# EAGLE design Color Sorter PROTOTYPE v3 DMJ Edit (EAGLE 6.4)
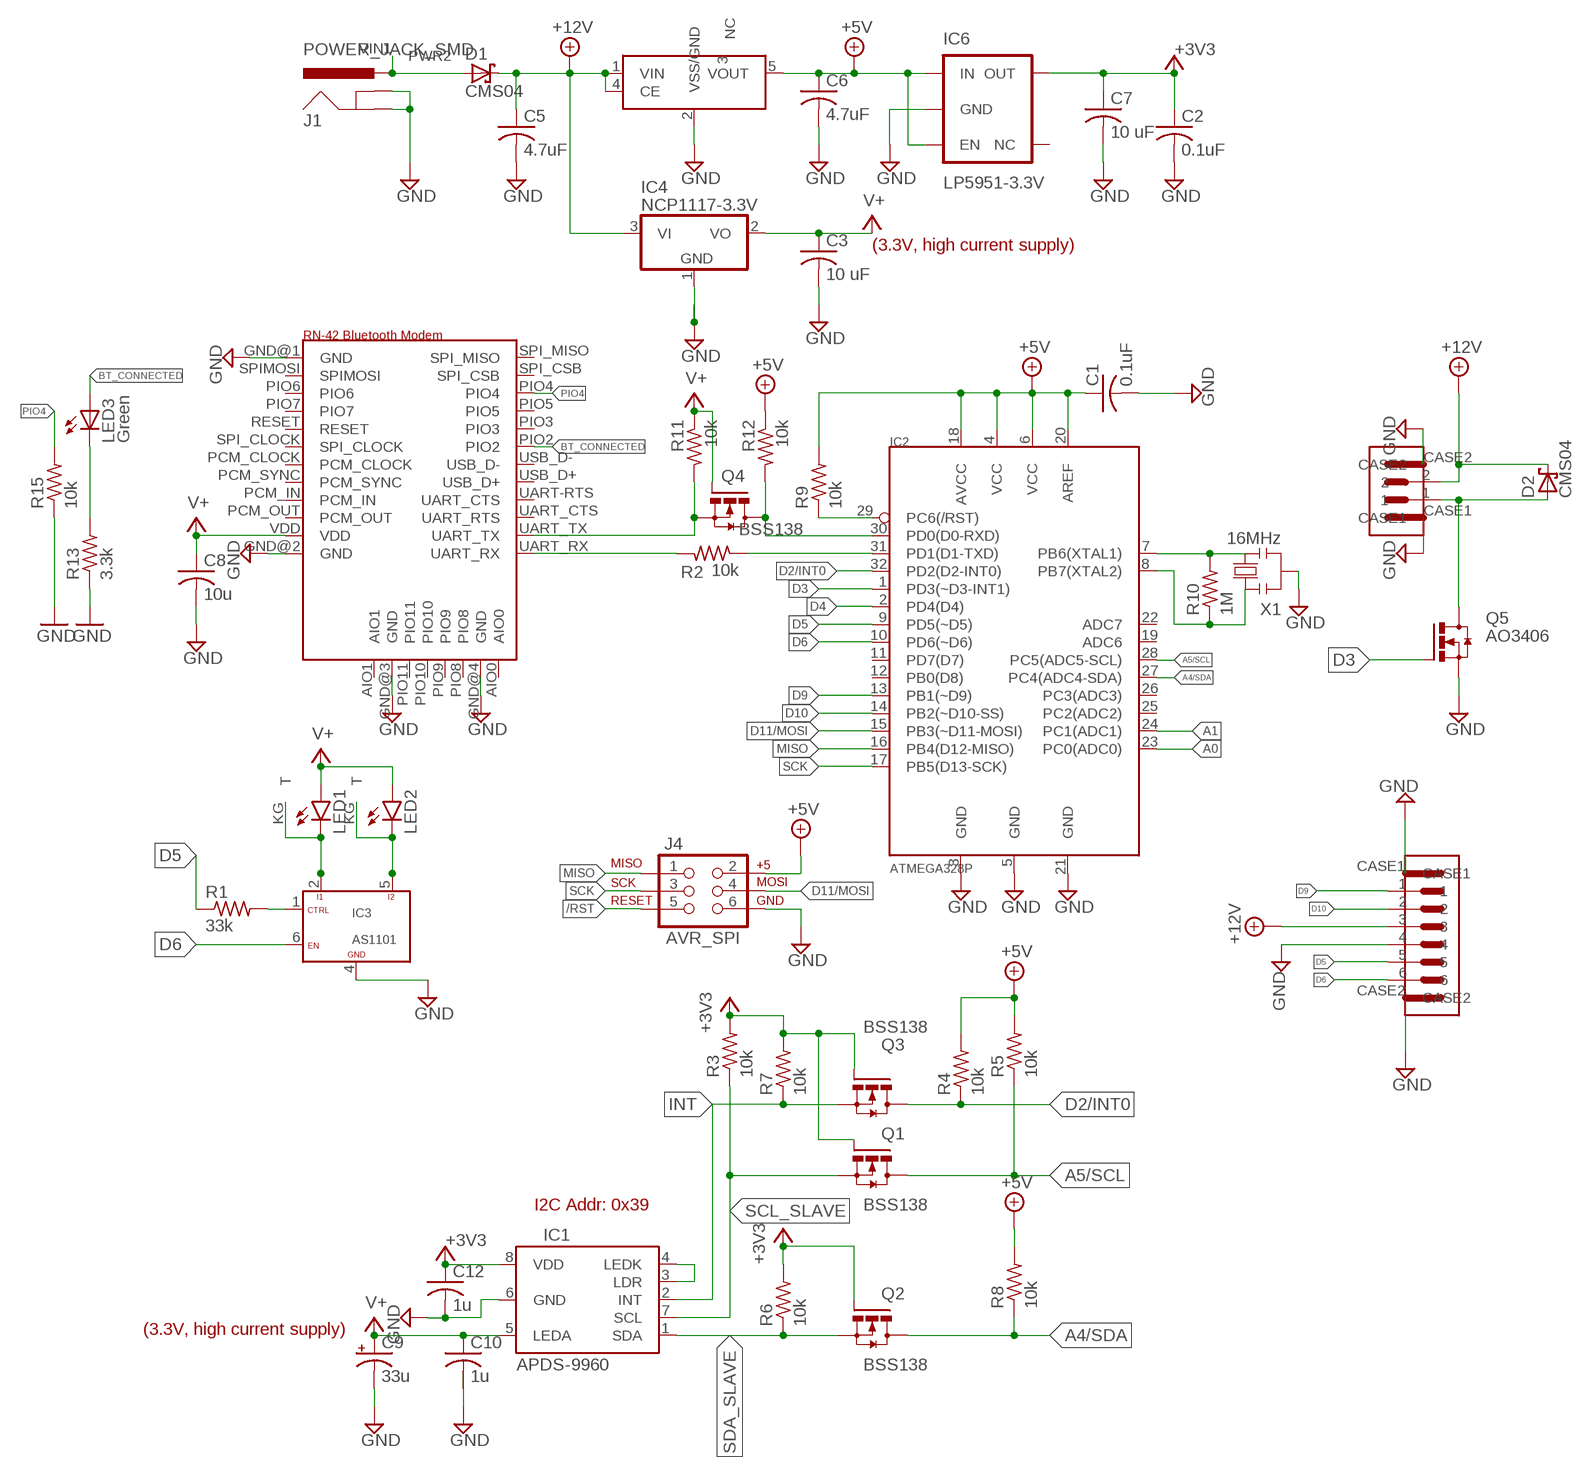
[diagram p0: schematic, sheet 1]

## Parts
A1  RN-42_BLUETOOTH  [RN-42]
C1  0.1uF  C-USC0805  [C0805]
C2  0.1uF  C-USC0805  [C0805]
C3  10 uF  C-USC0805  [C0805]
C5  4.7uF  C-USC0805  [C0805]
C6  4.7uF  C-USC0805  [C0805]
C7  10 uF  C-USC0805  [C0805]
C8  10u  C-USC0805  [C0805]
C9  33u  CPOL-USCT7343  [CT7343]
C10  1u  C-USC0805  [C0805]
C12  1u  C-USC0805  [C0805]
D1  CMS04  CMS04_SCHOTTKY  [3-4E1A]
D2  CMS04  CMS04_SCHOTTKY  [3-4E1A]
IC1  APDS-9960  SPARKFUN-SENSORS_APDS-9960  [SPARKFUN-SENSORS_APDS-9960]
IC2  ATMEGA328P  ATMEGA328P_TQFP  [TQFP-32]
IC3  AS1101  AS1101-T  [SC70-6]
IC4  NCP1117-3.3V  NCP1117_REGULATOR  [SOT-223]
IC5  XC6701-5V  DMJ_LINEAR_XC6701B502  [DMJ_LINEAR_SOT23-5]
IC6  LP5951-3.3V  [SOT23-5]
J1  POWER_JACK_SMD  [SMD_POWER_JACK]
J4  AVR_SPI  AVR_SPI_PRG_6PTH  [2X3]
LED1  LED_SAMSUNG_SPMWHT541MD7WATMS0  [LED_SAMSUNG_SPMWHT541MD7WATMS0]
LED2  LED_SAMSUNG_SPMWHT541MD7WATMS0  [LED_SAMSUNG_SPMWHT541MD7WATMS0]
LED3  Green  LED1206  [LED-1206]
Q1  BSS138  BE-420-CUSTOM-PARTS_BSS138_N_CHANNEL_MOSFET  [BE-420-CUSTOM-PARTS_SOT-23]
Q2  BSS138  BE-420-CUSTOM-PARTS_BSS138_N_CHANNEL_MOSFET  [BE-420-CUSTOM-PARTS_SOT-23]
Q3  BSS138  BE-420-CUSTOM-PARTS_BSS138_N_CHANNEL_MOSFET  [BE-420-CUSTOM-PARTS_SOT-23]
Q4  BSS138  BE-420-CUSTOM-PARTS_BSS138_N_CHANNEL_MOSFET  [BE-420-CUSTOM-PARTS_SOT-23]
Q5  AO3406  N_PWR_MOSFET_AO3406  [SOT-23-3]
R1  33k  R-US_R0805  [R0805]
R2  10k  R-US_R0805  [R0805]
R3  10k  R-US_R0805  [R0805]
R4  10k  R-US_R0805  [R0805]
R5  10k  R-US_R0805  [R0805]
R6  10k  R-US_R0805  [R0805]
R7  10k  R-US_R0805  [R0805]
R8  10k  R-US_R0805  [R0805]
R9  10k  R-US_R0805  [R0805]
R10  1M  R-US_R0805  [R0805]
R11  10k  R-US_R0805  [R0805]
R12  10k  R-US_R0805  [R0805]
R13  3.3k  R-US_R0805  [R0805]
R15  10k  R-US_R0805  [R0805]
U$4  1A-JENKINS-PHOENIX-CONTACT-CONNECTORS_1A_JENKINS_2013_6PIN_SMD_PHOENIX_CONTACT  [1A-JENKINS-PHOENIX-CONTACT-CONNECTORS_1A_JENKINS_2013_6-PIN-R/A_PHOENIX_SMD]
U$7  1A_JENKINS_2013_2PIN_SMD_PHOENIX_CONTACT  [1A_JENKINS_2013_2-PIN-R/A_PHOENIX_SMD]
X1  16MHz  1A_JENKINS_2013_CSTCE16MHZ  [1A_JENKINS_2013_RESONATOR_SMD]

## Nets
+3V3: C2.1 C7.1 C12.1 IC1.8(VDD) IC6.5(OUT) Q1.1-G(G) Q2.1-G(G) Q3.1-G(G) R3.2 R6.2 R7.2
+5V: C1.1 C6.1 IC2.4(VCC) IC2.6(VCC) IC2.18(AVCC) IC2.20(AREF) IC5.5(VOUT) IC6.1(IN) IC6.3(EN) J4.2 R4.2 R5.2 R8.2 R9.2 R12.1
+12V: C5.1 D1.C D2.C IC4.3(VI) IC5.1(VIN) IC5.4(CE) U$4.3 U$7.2
/RST: IC2.29(PC6(/RST)) J4.5 R9.1
A0: IC2.23(PC0(ADC0))
A1: IC2.24(PC1(ADC1))
A4/SDA: IC2.27(PC4(ADC4-SDA)) Q2.3-D(D) R8.1
A5/SCL: IC2.28(PC5(ADC5-SCL)) Q1.3-D(D) R5.1
BT_CONNECTED: A1.PIO2 LED3.A
D2/INT0: IC2.32(PD2(D2-INT0)) Q3.3-D(D) R4.1
D3: IC2.1(PD3(~D3-INT1)) Q5.1(G)
D4: IC2.2(PD4(D4))
D5: IC2.9(PD5(~D5)) R1.1 U$4.5
D6: IC2.10(PD6(~D6)) IC3.6(EN) U$4.6
D9: IC2.13(PB1(~D9)) U$4.1
D10: IC2.14(PB2(~D10-SS)) U$4.2
D11/MOSI: IC2.15(PB3(~D11-MOSI)) J4.4
GND: A1.GND@1(GND) A1.GND@2(GND) A1.GND@3(GND) A1.GND@4(GND) C1.2 C2.2 C3.2 C5.2 C6.2 C7.2 C8.2 C9.- C10.2 C12.2 IC1.6(GND) IC2.3(GND) IC2.5(GND) IC2.21(GND) IC3.4(GND) IC4.1(GND) IC5.2(VSS/GND) IC6.2(GND) J1.GND J1.P$4(GNDBREAK) J4.6 Q5.2(S) R13.1 R15.1 U$4.4 U$4.CASE1 U$4.CASE2 U$7.CASE1 U$7.CASE2 X1.2
INT: IC1.2(INT) Q3.2-S(S) R7.1
MISO: IC2.16(PB4(D12-MISO)) J4.1
N$1: IC2.31(PD1(D1-TXD)) R2.1
N$2: IC1.3(LDR) IC1.4(LEDK)
N$4: IC2.7(PB6(XTAL1)) R10.2 X1.3
N$5: IC3.2(I1) LED1.KA(C) LED1.KG(T)
N$6: IC3.5(I2) LED2.KA(C) LED2.KG(T)
N$8: A1.UART_RX R2.2
N$9: IC2.8(PB7(XTAL2)) R10.1 X1.1
N$10: D2.A Q5.3(D) U$7.1
N$11: A1.UART_TX Q4.2-S(S) R11.2
N$12: IC2.30(PD0(D0-RXD)) Q4.3-D(D) R12.2
N$16: LED3.C R13.2
N$22: IC3.1(CTRL) R1.2
PIO4: A1.PIO4 R15.2
SCK: IC2.17(PB5(D13-SCK)) J4.3
SCL_SLAVE: IC1.7(SCL) Q1.2-S(S) R3.1
SDA_SLAVE: IC1.1(SDA) Q2.2-S(S) R6.1
USB_VIN: D1.A J1.VIN0(PWR) J1.VIN1(PWR2)
V+: A1.VDD C3.1 C8.1 C9.+ C10.1 IC1.5(LEDA) IC4.2(VO) LED1.A LED2.A Q4.1-G(G) R11.1
Unconnected: A1.AIO0 A1.AIO1 A1.PCM_CLOCK A1.PCM_IN A1.PCM_OUT A1.PCM_SYNC A1.PIO3 A1.PIO5 A1.PIO6 A1.PIO7 A1.PIO8 A1.PIO9 A1.PIO10 A1.PIO11 A1.RESET A1.SPI_CLOCK A1.SPI_CSB A1.SPI_MISO A1.SPIMOSI A1.UART-RTS(UART_CTS) A1.UART_CTS(UART_RTS) A1.USB_D+ A1.USB_D- IC2.11(PD7(D7)) IC2.12(PB0(D8)) IC2.19(ADC6) IC2.22(ADC7) IC2.25(PC2(ADC2)) IC2.26(PC3(ADC3)) IC5.3(NC) IC6.4(NC)

## Notes on the sheet
- (3.3V, high current supply)
- I2C Addr: 0x39
- (3.3V, high current supply)

## Library data of the parts
A1 = be-420-custom-parts:RN-42_BLUETOOTH
C1-C3 C5-C8 C10 C12 = rcl:C-US: CAPACITOR, American symbol
C9 = rcl:CPOL-US: POLARIZED CAPACITOR, American symbol
D1 D2 = 1A_Jenkins_2013:CMS04_SCHOTTKY
IC1 = SparkFun_APDS-9960:SPARKFUN-SENSORS_APDS-9960: Avago APDS-9960 digital proximity, ambient light, RGB, and gesture sensor.; PROD_ID: SEN-12005
IC2 = 1A_Jenkins_2013:ATMEGA328P_TQFP
IC3 = 1A_Jenkins_2013:AS1101-T: AS1101 low dropout LED driver, 2 channel < 80 mA each
IC4 = 1A_Jenkins_2013:NCP1117_REGULATOR
IC5 = BE 420 Parts volume 2:DMJ_LINEAR_XC6701B502
IC6 = BE482:LP5951-3.3V
J1 = 1A_Jenkins_2013:POWER_JACK_SMD
J4 = SparkFun:AVR_SPI_PRG_6: AVR ISP 6 Pin This is the reduced ISP connector for AVR programming. Common on Arduino. This footprint will take up less PCB space and can be used with a 10-pin to 6-pin adapter such as SKU: BOB-08508
LED1 LED2 = 1A_Jenkins_2013:LED_SAMSUNG_SPMWHT541MD7WATMS0
LED3 = SparkFun:LED: LEDs Standard schematic elements and footprints for 5mm, 3mm, 1206, and 0603 sized LEDs. 5mm - Spark Fun Electronics SKU : COM-00529 (and others)
Q1-Q4 = BE 420 Parts volume 2:BE-420-CUSTOM-PARTS_BSS138_N_CHANNEL_MOSFET
Q5 = 1A_Jenkins_2013:N_PWR_MOSFET_AO3406
R1-R13 R15 = rcl:R-US_: RESISTOR, American symbol
U$4 = BE+420+Fall+2015:1A-JENKINS-PHOENIX-CONTACT-CONNECTORS_1A_JENKINS_2013_6PIN_SMD_PHOENIX_CONTACT
U$7 = 1A-Jenkins Phoenix Contact Connectors:1A_JENKINS_2013_2PIN_SMD_PHOENIX_CONTACT
X1 = BE 420 Parts volume 2:1A_JENKINS_2013_CSTCE16MHZ

## Net classes
1 VCC: width 0.381 mm
2 LEDPower: width 0.203 mm
3 ButtonSignal: width 0.203 mm

## Board
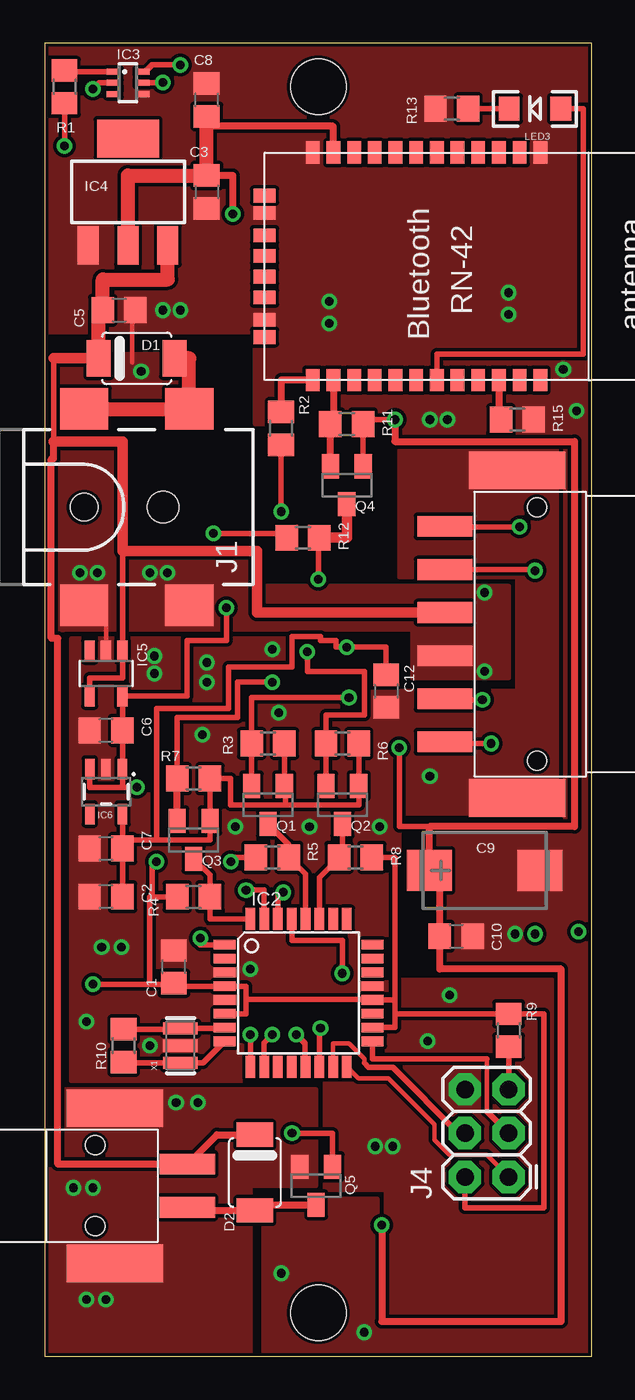
[diagram p1: board, top side]
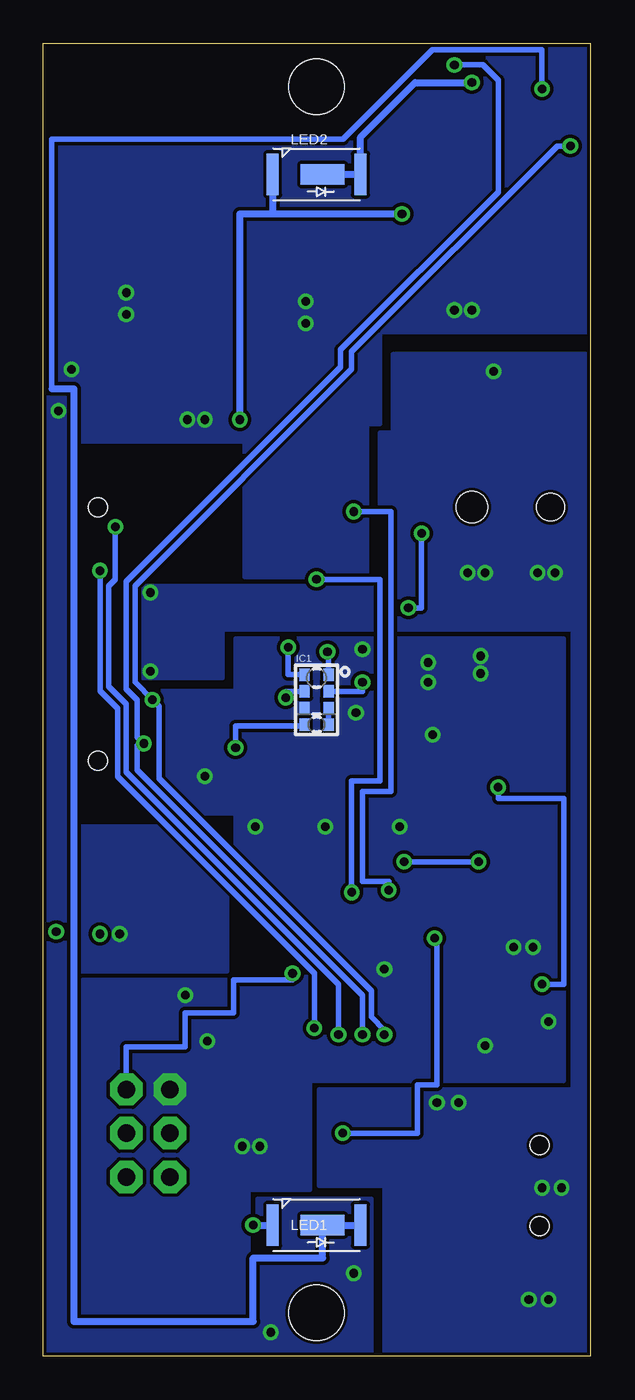
[diagram p2: board, bottom side, seen from below]

Size 31.75 x 76.2 mm. Coordinates in mm from the lower left corner, seen from the top.
Outline: 0,0 31.75,0 31.75,76.2 0,76.2 0,0
Copper layers (1*16): Top 0.035mm / dielectric 1.5mm / Bottom 0.035mm
Design rules "default *": minimum track width 10mil, minimum drill 18mil, track to track 8mil, track to pad 8mil, pad to pad 8mil, via to via 8mil, smd to smd 8mil, copper to edge 8mil, drill to drill 8mil, minimum pad ring 10mil, minimum via ring 8mil, stop-mask expansion 4mil, vias tented up to drill 0mil, thermal gap 10mil
Holes 3.2 mm at 15.88,2.54 15.88,73.66

### Footprints (pad centres in the part's own frame; a part is rotated, then mirrored left to right if it is on the bottom)
RN-42 = smd 0.8 x 1.3: AIO0 4.1,-12.9; AIO1 -4.1,-12.9; GND@3 -3.1,-12.9; GND@4 3.1,-12.9; PIO8 1.8,-12.9; PIO9 0.6,-12.9; PIO10 -0.6,-12.9; PIO11 -1.8,-12.9 | smd 1.3 x 0.8: GND@1 -6.6,3.1; GND@2 -6.6,-10.1; PCM_CLOCK -6.6,-4.1; PCM_IN -6.6,-6.5; PCM_OUT -6.6,-7.7; PCM_SYNC -6.6,-5.3; PIO2 6.6,-2.9; PIO3 6.6,-1.7; PIO4 6.6,0.7; PIO5 6.6,-0.5; PIO6 -6.6,0.7; PIO7 -6.6,-0.5; RESET -6.6,-1.7; SPI_CLOCK -6.6,-2.9; SPI_CSB 6.6,1.9; SPI_MISO 6.6,3.1; SPIMOSI -6.6,1.9; UART-RTS 6.6,-7.7; UART_CTS 6.6,-6.5; UART_RX 6.6,-10.1; UART_TX 6.6,-8.9; USB_D+ 6.6,-5.3; USB_D- 6.6,-4.1; VDD -6.6,-8.9
C0805 = smd 1.3 x 1.5: 1 -0.95,0; 2 0.95,0
CT7343 = smd 2.6 x 2.4: + -3.2,0; - 3.2,0
3-4E1A = smd 1.4 x 2.1: A 2.2,0; C -2.2,0
SPARKFUN-SENSORS_APDS-9960 = smd 0.6 x 0.72: 1 0.7,1.455; 2 0.7,0.485; 3 0.7,-0.485; 4 0.7,-1.455; 5 -0.7,-1.455; 6 -0.7,-0.485; 7 -0.7,0.485; 8 -0.7,1.455
TQFP-32 = smd 1.27 x 0.559: 1 -4.293,2.8; 2 -4.293,2; 3 -4.293,1.2; 4 -4.293,0.4; 5 -4.293,-0.4; 6 -4.293,-1.2; 7 -4.293,-2; 8 -4.293,-2.8; 17 4.293,-2.8; 18 4.293,-2; 19 4.293,-1.2; 20 4.293,-0.4; 21 4.293,0.4; 22 4.293,1.2; 23 4.293,2; 24 4.293,2.8 | smd 0.559 x 1.27: 9 -2.8,-4.293; 10 -2,-4.293; 11 -1.2,-4.293; 12 -0.4,-4.293; 13 0.4,-4.293; 14 1.2,-4.293; 15 2,-4.293; 16 2.8,-4.293; 25 2.8,4.293; 26 2,4.293; 27 1.2,4.293; 28 0.4,4.293; 29 -0.4,4.293; 30 -1.2,4.293; 31 -2,4.293; 32 -2.8,4.293
SC70-6 = smd 0.35 x 0.8: 1 -0.63,-0.85; 2 0.02,-0.85; 3 0.67,-0.85; 4 0.67,0.85; 5 0.02,0.85; 6 -0.63,0.85
SOT-223 = smd 1.219 x 2.235: 1 -2.311,-3.099; 2 0,-3.099; 3 2.311,-3.099 | smd 3.6 x 2.2: 4 0,3.099
DMJ_LINEAR_SOT23-5 = smd 0.6 x 1.2: 1 -0.95,-1.306; 2 0,-1.306; 3 0.95,-1.306; 4 0.95,1.306; 5 -0.95,1.306
SOT23-5 = smd 0.55 x 1.2: 1 -0.95,-1.3; 2 0,-1.3; 3 0.95,-1.3; 4 0.95,1.3; 5 -0.95,1.3
SMD_POWER_JACK = smd 2.8 x 2.4: GND -2.54,-5.7; P$4 3.56,-5.7; VIN0 -2.54,5.7; VIN1 3.56,5.7 | hole 1.6: -2.54,0 | hole 1.803: 2.032,0
2X3 = drill 1.016 pad 1.88 octagon: 1 0,0; 2 0,2.54; 3 2.54,0; 4 2.54,2.54; 5 5.08,0; 6 5.08,2.54
LED_SAMSUNG_SPMWHT541MD7WATMS0 = smd 0.7 x 2.4: A -2.55,0; KA 2.55,0 | smd 2.55 x 1.18: KG 0.35,0
LED-1206 = smd 1.2 x 1.4: A -1.5,0; C 1.5,0
BE-420-CUSTOM-PARTS_SOT-23 = smd 1 x 1.4: 1-G -0.95,-1.1; 2-S 0.95,-1.1; 3-D 0,1.1
SOT-23-3 = smd 1.4 x 1: 1 -1.1,0.95; 2 -1.1,-0.95; 3 1.1,0
R0805 = smd 1.3 x 1.5: 1 -0.95,0; 2 0.95,0
1A-JENKINS-PHOENIX-CONTACT-CONNECTORS_1A_JENKINS_2013_6-PIN-R/A_PHOENIX_SMD = smd 1.2 x 3.2: 1 6.25,3.45; 2 3.75,3.45; 3 1.25,3.45; 4 -1.25,3.45; 5 -3.75,3.45; 6 -6.25,3.45 | smd 2.2 x 5.6: CASE1 9.5,-0.75; CASE2 -9.5,-0.75 | hole 1.1: -7.35,-1.9; 7.35,-1.9
1A_JENKINS_2013_2-PIN-R/A_PHOENIX_SMD = smd 1.2 x 3.2: 1 1.25,3.45; 2 -1.25,3.45 | smd 2.2 x 5.6: CASE1 4.5,-0.75; CASE2 -4.5,-0.75 | hole 1.1: -2.35,-1.9; 2.35,-1.9
1A_JENKINS_2013_RESONATOR_SMD = smd 0.7 x 2: 1 -1,0; 2 0,0; 3 1,0

### Placement (x,y rotation side)
A1  25.65,63.25 270 top
C1  7.49,22.61 90 top
C2  3.56,26.67 180 top
C3  9.4,67.56 270 top
C5  4.32,60.71 0 top
C6  3.56,36.32 180 top
C7  3.56,29.46 180 top
C8  9.4,72.9 90 top
C9  25.53,28.19 0 top
C10  23.88,24.38 0 top
C12  19.81,38.61 270 top
D1  5.33,57.91 0 top
D2  12.19,10.67 270 top
IC1  15.88,38.1 0 bottom
IC2  14.73,21.08 0 top
IC3  4.83,73.91 270 top
IC4  4.83,67.56 0 top
IC5  3.56,39.62 180 top
IC6  3.56,32.77 180 top
J1  4.83,49.28 0 top
J4  26.92,10.41 90 top
LED1  15.88,7.62 0 bottom
LED2  15.88,68.58 0 bottom
LED3  28.45,72.39 180 top
Q1  12.95,32 180 top
Q2  17.27,32 180 top
Q3  8.64,29.97 180 top
Q4  17.53,50.55 180 top
Q5  15.75,9.91 270 top
R1  1.14,73.66 90 top
R2  13.72,53.85 90 top
R3  12.95,35.56 0 top
R4  8.64,26.67 180 top
R5  13.21,28.96 180 top
R6  17.27,35.56 0 top
R7  8.64,33.53 0 top
R8  18.03,28.96 0 top
R9  26.92,18.92 90 top
R10  4.57,18.03 90 top
R11  17.53,54.1 180 top
R12  14.99,47.5 0 top
R13  23.62,72.39 0 top
R15  27.43,54.36 180 top
U$4  26.67,41.91 90 top
U$7  4.83,9.91 270 top
X1  7.87,18.03 90 top

### Tracks (layer width: path | path; a pad name or v marks a point on that pad's centre or on a via)
+3V3  (via drill 0.5)
  Top 0.305: C12.1 19.81,41.15 v17.53,41.15 16.89,41.15 16.89,41.53 16,41.53 16,41.78 14.35,41.78 14.35,40.01 10.67,40.01 10.67,37.59 6.48,37.59 6.48,29.97 | IC6.5 4.51,29.97 | 4.51,29.97 C7.1 C2.1 | 6.48,29.97 9.59,29.97 Q3.1-G R7.2 10.79,33.53 10.79,32 13.97,32 | 6.48,29.97 4.51,29.97 | 13.97,32 18.22,32 Q2.1-G R6.2 | 13.97,32 13.97,33.1 Q1.1-G R3.2
  Bottom 0.305: IC1.8 17.53,39.55 v17.53,41.15
+5V  (via drill 0.5)
  Top 0.305: 4.51,33.02 IC6.1 C6.1 IC5.5 8.26,38.32 8.26,41.53 10.54,41.53 v10.54,43.43 | 4.51,33.02 2.61,33.02 IC6.3 | 4.51,33.02 v5.33,33.02 | 6.1,21.59 7.87,21.59 C1.1 8.05,21.48 IC2.4 11.68,21.48 11.68,20.7 | 11.68,20.7 11.68,19.88 IC2.6 | R4.2 6.22,26.67 | 6.22,26.67 6.1,26.67 6.1,21.59 | R5.2 10.79,28.96 v10.79,28.7 | v6.48,28.7 6.22,28.7 6.22,26.67 | R8.2 20.32,28.96 20.32,20.68 | 20.32,20.68 IC2.20 19.02,20.7 11.68,20.7 | IC2.18 20.32,19.08 20.32,19.87 | 20.32,19.87 20.32,20.68 | 20.32,19.87 R9.2 28.96,19.87 28.96,8.64 24.38,8.64 J4.2 | v9.78,47.75 14.04,47.75 R12.1 | 6.1,21.59 v2.79,21.59
  Bottom 0.305: v5.33,33.02 5.33,32.38 1.52,32.38 1.52,21.59 v2.79,21.59 | v10.79,28.7 v6.48,28.7 | v9.78,47.75 9.78,43.43 v10.54,43.43
+12V
  Top 0.305: 0.51,57.91 0.51,53.09 | 4.51,46.74 IC5.1 4.51,39.37 2.61,39.37 IC5.4
  Top 0.406: 0.51,53.09 0.51,52.07 0.38,52.07 0.38,41.66 0.76,41.66 0.76,11.16 U$7.2 9.99,12.87 D2.C
  Top 0.61: D1.C 0.51,57.91 | 0.51,53.09 4.51,53.09 4.51,46.74 12.32,46.74 12.32,43.16 U$4.3
  Top 0.813: D1.C 3.13,60.71 C5.1 3.37,62.48 7.14,62.48 IC4.3
/RST  (via drill 0.5)
  Top 0.305: J4.5 R9.1 | v17.27,22.23 17.27,24.13 14.35,24.13 14.35,25.38 IC2.29
  Bottom 0.305: J4.5 R9.1 23.5,17.97 23.5,19.94 20.7,19.94 20.7,21.84 17.27,21.84 v17.27,22.23
A4/SDA
  Top 0.305: IC2.27 15.93,27.8 R8.1 17.27,29.14 Q2.3-D
A5/SCL
  Top 0.305: IC2.28 15.13,27.98 R5.1 14.16,29.7 Q1.3-D
BT_CONNECTED
  Top 0.305: A1.PIO2 22.75,58.17 31.24,58.17 31.24,72.39 LED3.A
D2/INT0
  Top 0.305: IC2.32 9.59,25.38 R4.1 9.59,27.92 Q3.3-D
D3  (via drill 0.5)
  Top 0.305: IC2.1 9.02,23.88 v9.02,24.26 | v14.35,12.95 16.7,12.95 Q5.1
  Bottom 0.305: v9.02,24.26 8.89,24.26 8.89,15.75 10.03,15.75 10.03,12.95 v14.35,12.95
D5  (via drill 0.5)
  Top 0.305: v25.4,38.1 23.28,38.1 U$4.5 | R1.1 v1.14,70.23 | IC2.9 v11.93,18.66 v11.94,18.67
  Bottom 0.305: v1.14,70.23 1.91,70.23 13.84,58.29 13.84,57.28 26.42,44.7 26.42,39.12 v25.4,38.1 25.02,37.72 25.02,33.53 12.7,21.21 12.7,19.68 11.94,18.92 v11.94,18.67
D6  (via drill 0.5)
  Top 0.305: v25.91,35.56 23.32,35.56 U$4.6 | IC3.6 5.84,74.54 6.22,74.93 v7.87,74.93 | IC2.10 12.73,18.19 v13.21,18.67
  Bottom 0.305: v7.87,74.93 6.22,74.93 5.33,74.04 5.33,67.56 14.48,58.42 14.48,57.4 26.92,44.96 26.92,38.73 26.29,38.1 26.29,35.94 v25.91,35.56 26.29,35.43 26.29,34.04 13.21,20.95 v13.21,18.67
D9  (via drill 0.5)
  Top 0.305: IC2.13 15.11,16.81 15.11,18.16 v14.61,18.67 | v27.56,48.13 23.25,48.13 U$4.1
  Bottom 0.305: v14.61,18.67 14.61,21.59 26.92,33.91 26.92,37.85 27.94,38.86 27.94,44.7 27.56,45.09 v27.56,48.13
D10  (via drill 0.5)
  Top 0.305: IC2.14 15.93,18.99 v16,19.05 | v28.45,45.59 28.38,45.66 U$4.2
  Bottom 0.305: v16,19.05 16,22.23 27.43,33.66 27.43,37.59 28.45,38.61 v28.45,45.59
D11/MOSI
  Top 0.254: 18.54,17.02 18.54,17.27 17.65,18.16 16.73,18.16 IC2.15
  Top 0.305: J4.4 24,12.95 20.19,16.76 18.8,16.76 18.54,17.02
GND  (via drill 0.5)
  Top 0.254: 5.08,57.66 5.08,59.94 | 3.56,42.67 3.56,41.15
  other vias: 2.03,45.47 3.05,45.47 6.1,45.47 7.11,45.47 5.59,57.15 6.86,60.71 7.87,60.71 6.35,40.64 6.35,39.62 22.35,54.36 23.37,54.36 16.51,59.94 16.51,61.21 26.92,60.45 26.92,61.72 6.1,18.03 1.65,9.78 2.79,9.78 2.41,3.3 3.56,3.3 7.62,14.73 8.89,14.73 25.53,44.32 25.53,39.75 27.3,24.51 30.86,54.86 18.54,1.4 13.72,4.83 11.94,22.48 2.41,19.43 19.18,12.19 20.19,12.19 22.23,18.29 23.5,20.95 3.3,23.75 4.45,23.75 22.35,33.66 19.43,30.73 30.1,57.28 9.4,40.26 9.4,39.12 13.21,41.02 13.59,37.34 9.14,36.07 15.37,30.73 11.05,30.73
  pour Bottom (no thermals): 0,58.17 11.43,58.17 11.43,53.59 12.19,53.59 12.19,44.7 26.92,44.7 26.92,39.37 21.34,39.37 21.34,42.16 1.02,42.16 1.02,15.49 15.75,15.49 15.75,9.91 11.94,9.91 11.94,0 0,0
  pour Top (no thermals): 0,58.17 11.43,58.17 11.43,53.59 12.19,53.59 12.19,44.7 26.92,44.7 26.92,39.37 21.34,39.37 21.34,42.16 1.02,42.16 1.02,15.49 15.75,15.49 15.75,9.91 11.94,9.91 11.94,0 0,0
  pour Top (no thermals): 0,76.2 31.75,76.2 31.75,0 12.7,0 12.7,9.14 19.3,9.14 19.3,1.78 29.97,1.78 29.97,22.35 21.08,22.35 21.08,30.73 30.23,30.73 30.23,53.09 20.07,53.09 20.07,45.21 12.95,45.21 12.95,54.1 12.19,54.1 12.19,59.44 0,59.44
  pour Bottom (no thermals): 0,76.2 31.75,76.2 31.75,0 12.7,0 12.7,9.14 19.3,9.14 19.3,1.78 29.97,1.78 29.97,22.35 21.08,22.35 21.08,30.73 30.23,30.73 30.23,53.09 20.07,53.09 20.07,45.21 12.95,45.21 12.95,54.1 12.19,54.1 12.19,59.44 0,59.44
  pour Bottom (no thermals): 1.52,41.66 20.57,41.66 20.57,38.61 27.43,38.61 27.43,45.21 20.57,45.21 20.57,52.58 29.72,52.58 29.72,31.5 20.57,31.5 20.57,21.84 29.46,21.84 29.46,2.29 19.81,2.29 19.81,9.65 16.26,9.65 16.26,16 1.52,16
  pour Top (no thermals): 1.52,41.66 20.57,41.66 20.57,38.61 27.43,38.61 27.43,45.21 20.57,45.21 20.57,52.58 29.72,52.58 29.72,31.5 20.57,31.5 20.57,21.84 29.46,21.84 29.46,2.29 19.81,2.29 19.81,9.65 16.26,9.65 16.26,16 1.52,16
INT  (via drill 0.5)
  Top 0.305: v13.21,39.12 11.18,39.12 11.18,37.08 7.69,37.08 R7.1
  Top 0.406: Q3.2-S R7.1
  Bottom 0.305: IC1.2 13.21,38.59 v13.21,39.12
MISO
  Top 0.254: J4.1 25.65,11.68 23.5,11.68 22.61,12.57 22.61,13.46 19.94,16.13 18.19,16.13 IC2.16
N$1  (via drill 0.5)
  Top 0.305: IC2.31 12.73,27.05 v11.68,27.05 | v13.72,49.02 R2.1
  Bottom 0.305: v11.68,27.05 11.68,27.56 13.21,27.56 13.21,32.77 11.56,32.77 11.56,49.02 v13.72,49.02
N$2
  Bottom 0.305: IC1.3 IC1.4
N$4
  Top 0.305: IC2.7 10.39,19.03 X1.3 7.82,18.98 R10.2
N$5  (via drill 0.5)
  Top 0.305: IC3.2 3.15,73.89 v2.79,73.53
  Bottom 0.305: v2.79,73.53 2.79,75.82 9.14,75.82 14.35,70.61 31.24,70.61 31.24,56.13
  Bottom 0.406: LED1.KA LED1.KG 15.53,5.71 19.56,5.71 19.56,2.03 29.97,2.03 29.97,56.13 31.24,56.13
N$6  (via drill 0.5)
  Top 0.305: IC3.5 6.86,73.89
  Top 0.406: v6.86,73.91 6.86,73.89
  Bottom 0.406: LED2.KG LED2.KA 13.32,70.75 10.16,73.91 v6.86,73.91
N$7  (via drill 0.5)
  other vias: 28.45,24.51
N$8
  Top 0.406: A1.UART_RX 13.72,56.65 R2.2
N$9
  Top 0.305: R10.1 5.13,17.03 X1.1 9.19,17.03 IC2.8
N$10
  Top 0.406: U$7.1 8.46,8.47 D2.A 12.53,8.81 Q5.3
N$11
  Top 0.406: A1.UART_TX 16.75,54.1 R11.2 Q4.2-S
N$12  (via drill 0.5)
  Top 0.305: IC2.30 13.53,26.92 v13.84,26.92 | v15.88,45.09 15.88,47.5 R12.2
  Top 0.61: Q4.3-D 17.53,47.5 R12.2
  Bottom 0.305: v13.84,26.92 13.84,33.4 12.19,33.4 12.19,45.09 v15.88,45.09
N$15  (via drill 0.5)
  other vias: 30.99,24.64
N$16
  Top 0.305: LED3.C R13.2
N$22
  Top 0.305: IC3.1 1.52,74.54 R1.2
PIO4
  Top 0.406: A1.PIO4 26.35,54.36 R15.2
SCK
  Top 0.254: 25.65,14.22 25.65,17.27
  Top 0.305: J4.3 25.65,14.22 | 25.65,17.27 19.02,17.27 IC2.17
SCL_SLAVE  (via drill 0.5)
  Top 0.305: v17.65,38.23 12,38.23 R3.1 Q1.2-S
  Bottom 0.305: IC1.7 17.65,38.59 v17.65,38.23
SDA_SLAVE  (via drill 0.5)
  Top 0.305: Q2.2-S R6.1 16.32,37.21 18.54,37.21 18.54,39.75 15.24,39.75 v15.24,40.89
  Top 0.406: 16.26,35.56 R6.1
  Bottom 0.305: IC1.1 15.18,40.89 v15.24,40.89
USB_VIN
  Top 0.813: J1.VIN0 J1.VIN1 8.39,57.91 D1.A
V+  (via drill 0.5)
  Top 0.305: v20.32,54.36 18.48,54.36 | Q4.1-G R11.1 | 22.33,30.73 20.57,30.73 v20.57,35.31
  Top 0.406: v10.92,66.29 10.92,68.51 C3.1 | A1.VDD 16.75,71.37 9.4,71.37 | v19.56,7.62 19.56,2.03 29.97,2.03 29.97,22.48 22.93,22.48 C10.1 22.93,28.45 C9.+ 22.33,30.73 30.73,30.73 30.73,53.09 20.32,53.09 v20.32,54.36
  Top 0.61: R11.1 18.48,54.36
  Top 0.813: IC4.2 4.83,68.51 C3.1 9.4,71.37 C8.1
  Bottom 0.305: 16.57,36.58 20.57,36.58 v20.57,35.31
  Bottom 0.406: LED2.A 18.43,66.29 | 18.43,66.29 v10.92,66.29 | v20.32,54.36 20.32,66.29 18.43,66.29 | v19.56,7.62 LED1.A | IC1.5 16.57,36.58

### Text on the board
tDocu: D9 | D10 | +12V | GND | D5 | D6 | + | - | (solenoid)
bDocu: Taylor Hori & Tiffany Ulep / BE 482 Project, Spring 2016 / Coffee Cherry Color Sorter (v2) / January 28, 2016 / D5- Current Set on LED Driver / D6- Enable on LED Driver / D9 & D10 allow external digital comm / i2c address APDS-9960 0x39 | (Center Positive, 6 - 18V)